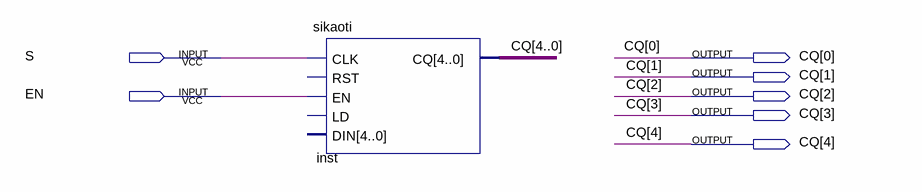
[diagram p0: schematic sheet]
// Quartus schematic sikaoti1.bdf as structural Verilog: 1 symbols, 7 pins
module sikaoti1 (
  input  S,
  input  EN,
  output [4:0] CQ
);

  sikaoti inst (.CLK(S), .EN(EN), .CQ(CQ));  // open: RST, LD, DIN
endmodule
